# Altium schematic sheet stm32_schematic.SchDoc
size A3; SheetNumber: 1; SheetTotal: 1
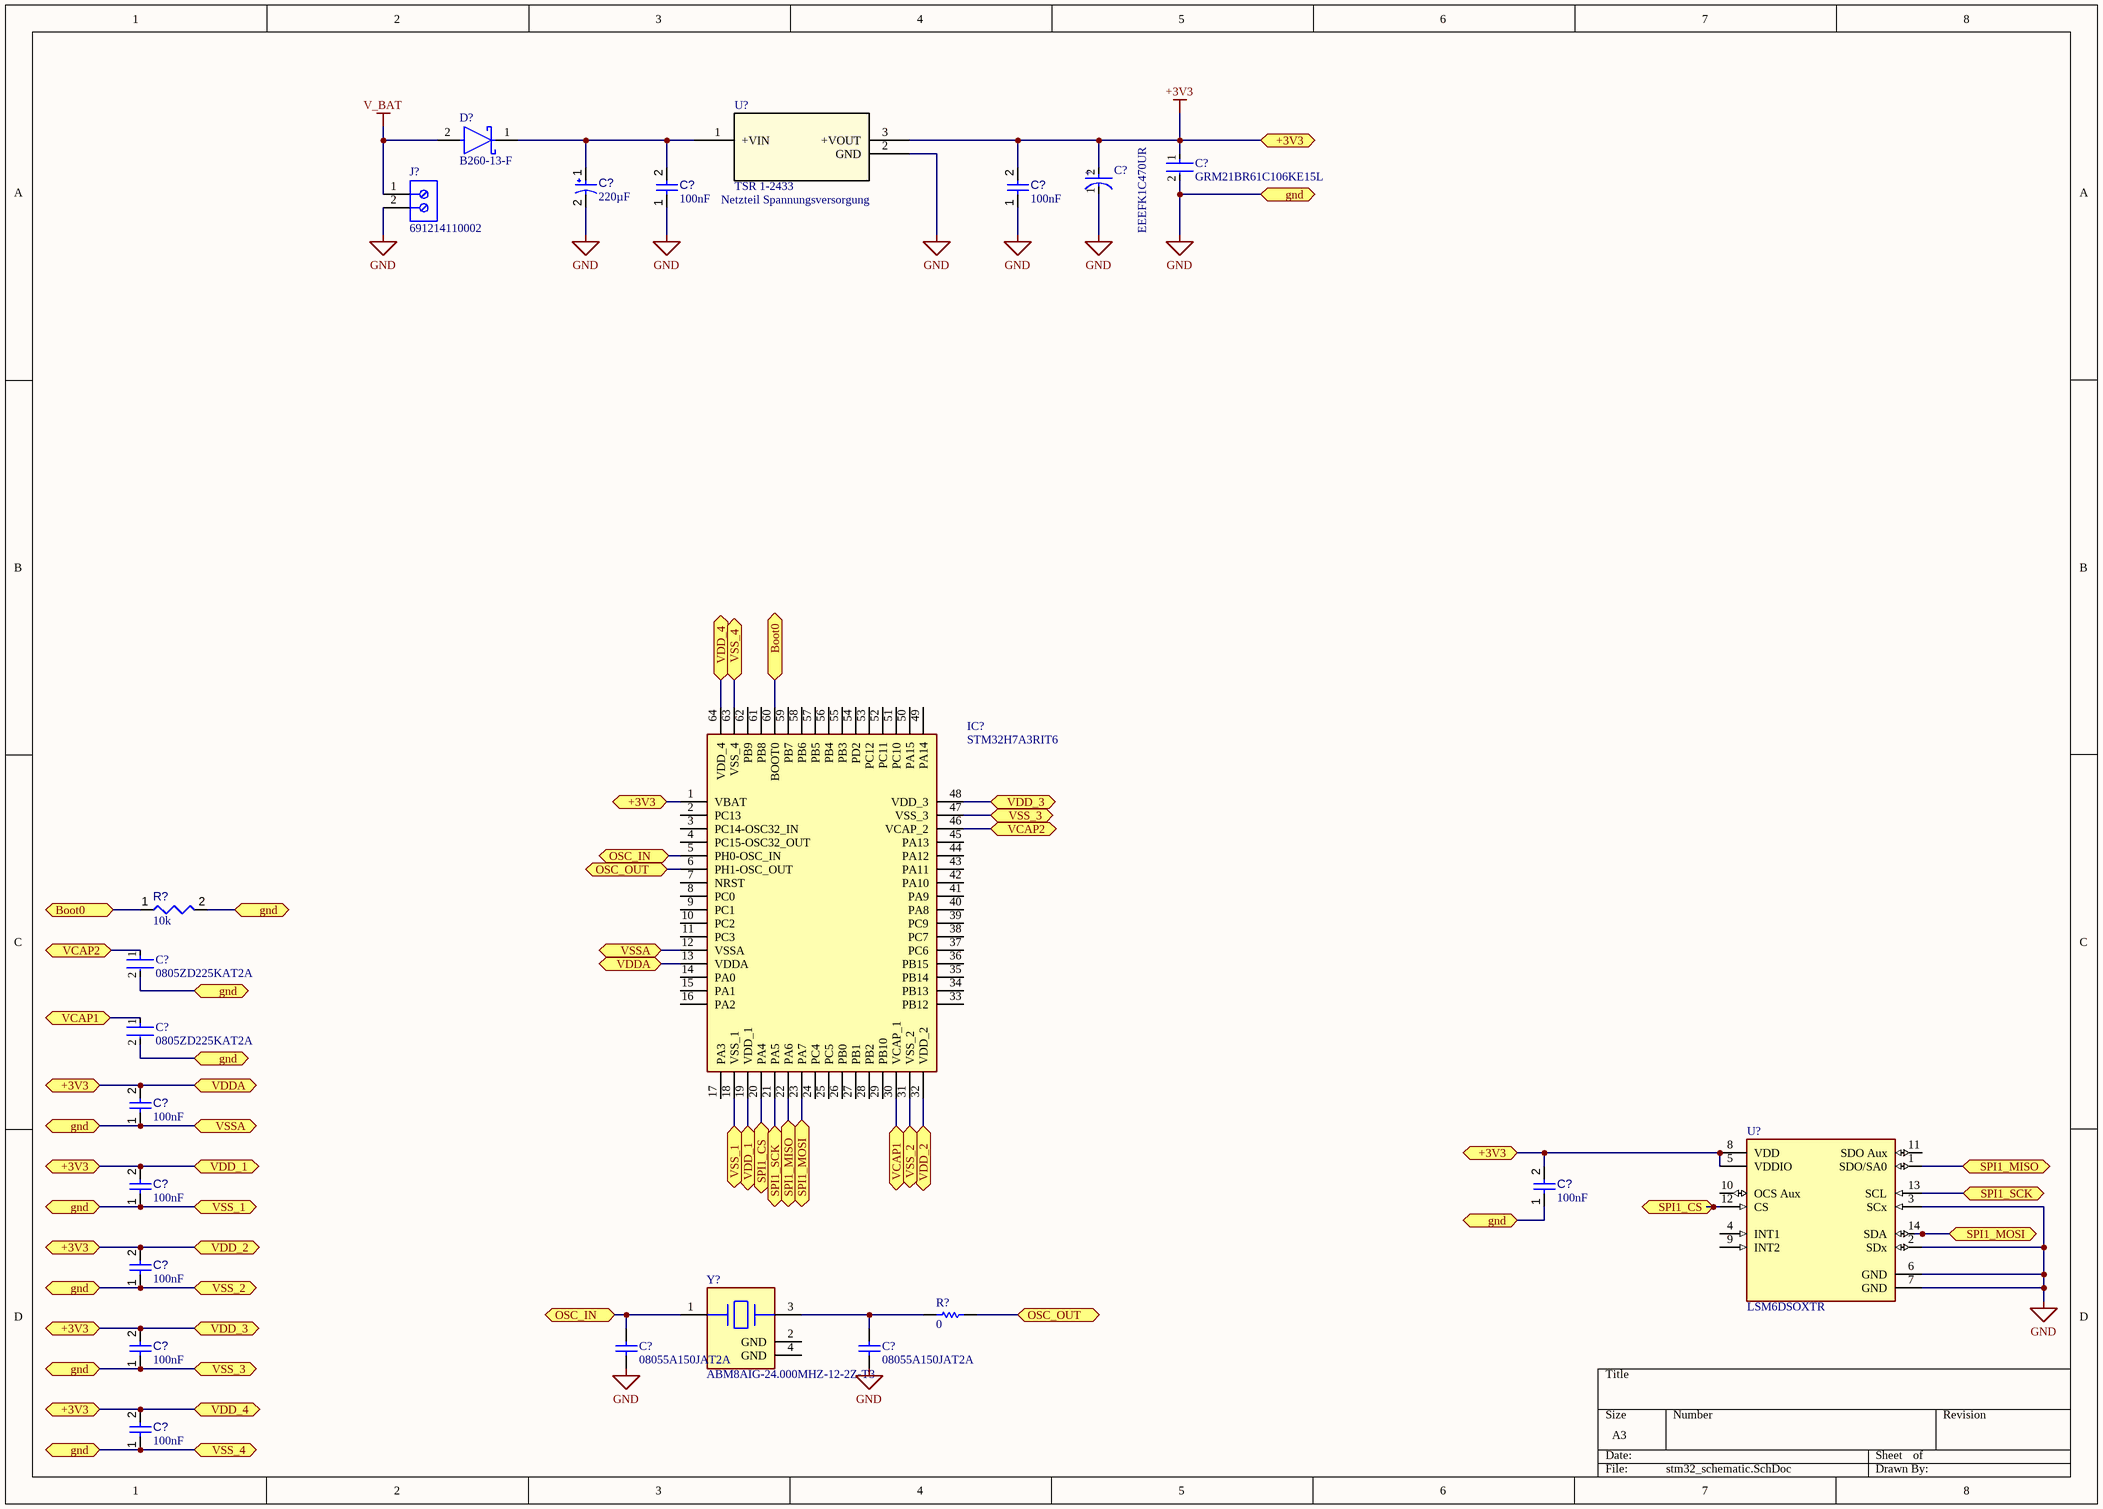
[diagram p0: stm32_schematic.SchDoc]

## Parts
(Parts that share a designator on the sheet are numbered #1, #2 ... from top to bottom, then left to right.)
C?#1  GRM21BR61C106KE15L  [FP-GRM21B-0_1-IPC_C]
C?#2  value 220µF  [CAPPR65-500-1250X1000X1350]  (hidden comment: ECA-1HM221)
C?#3  EEEFK1C470UR  [FP-FKC-MFG]
C?#4  value 100nF  [CAPC2013X95X50LL10T25]  (hidden comment: Capacitor 100 nF +/-10% 50 V 0805)
C?#5  value 100nF  [CAPC2013X95X50LL10T25]  (hidden comment: Capacitor 100 nF +/-10% 50 V 0805)
C?#6  0805ZD225KAT2A  [FP-0805-L_2_01_0_2-W_1_25-IPC_B]
C?#7  0805ZD225KAT2A  [FP-0805-L_2_01_0_2-W_1_25-IPC_B]
C?#8  value 100nF  [CAPC2013X95X50LL10T25]  (hidden comment: Capacitor 100 nF +/-10% 50 V 0805)
C?#9  value 100nF  [CAPC2013X95X50LL10T25]  (hidden comment: Capacitor 100 nF +/-10% 50 V 0805)
C?#10  value 100nF  [CAPC2013X95X50LL10T25]  (hidden comment: Capacitor 100 nF +/-10% 50 V 0805)
C?#11  value 100nF  [CAPC2013X95X50LL10T25]  (hidden comment: Capacitor 100 nF +/-10% 50 V 0805)
C?#12  08055A150JAT2A  [CAPC2013X140X50LL20T25]
C?#13  08055A150JAT2A  [CAPC2013X140X50LL20T25]
C?#14  value 100nF  [CAPC2013X95X50LL10T25]  (hidden comment: Capacitor 100 nF +/-10% 50 V 0805)
C?#15  value 100nF  [CAPC2013X95X50LL10T25]  (hidden comment: Capacitor 100 nF +/-10% 50 V 0805)
D?  B260-13-F  [FP-SMB-MFG]
IC?  STM32H7A3RIT6  [QFP50P1200X1200X160-64N]
J?  691214110002  [691214110002]
R?#1  value 10k  [RESC2013X50X35ML15T15]  (hidden comment: Resistor 10k +/-1% 0805 125 mW)
R?#2  value 0  [RESC2013X60X35ML10T20]  (hidden comment: Resistor 0R +/- 5% 0805 125 mW)
U?#1  TSR 1-2433  [TSR1-SINGLE_TRP]
U?#2  LSM6DSOXTR  [FP-LGA-14L-DM00249496-MFG]
Y?  ABM8AIG-24.000MHZ-12-2Z-T3  [FP-ABM8AIG-MFG]

## Ports
+3V3 (bidir, see stm32_schematic[1C], stm32_schematic[1D], stm32_schematic[3C], stm32_schematic[5A]), +3V3 (bidir, see stm32_schematic[1C], stm32_schematic[1D], stm32_schematic[3C], stm32_schematic[5A], stm32_schematic[6D]), +3V3 (bidir, see stm32_schematic[1C], stm32_schematic[1D], stm32_schematic[3C], stm32_schematic[6D]), +3V3 (bidir, see stm32_schematic[1C], stm32_schematic[1D], stm32_schematic[5A], stm32_schematic[6D]), +3V3 (bidir, see stm32_schematic[1D], stm32_schematic[3C], stm32_schematic[5A], stm32_schematic[6D]), Boot0 (bidir, see stm32_schematic[1C]), Boot0 (bidir, see stm32_schematic[3B]), gnd (bidir, see stm32_schematic[1C], stm32_schematic[1D], stm32_schematic[5A]), gnd (bidir, see stm32_schematic[1C], stm32_schematic[1D], stm32_schematic[5A], stm32_schematic[6D]), gnd (bidir, see stm32_schematic[1C], stm32_schematic[1D], stm32_schematic[6D]), OSC_IN (bidir, see stm32_schematic[3C]), OSC_IN (bidir, see stm32_schematic[3D]), OSC_OUT (bidir, see stm32_schematic[3C]), OSC_OUT (bidir, see stm32_schematic[4D]), SPI1_CS (bidir, see stm32_schematic[3D]), SPI1_CS (bidir, see stm32_schematic[7D]), SPI1_MISO (bidir, see stm32_schematic[3D]), SPI1_MISO (bidir, see stm32_schematic[8D]), SPI1_MOSI (bidir, see stm32_schematic[4D]), SPI1_MOSI (bidir, see stm32_schematic[8D]), SPI1_SCK (bidir, see stm32_schematic[3D]), SPI1_SCK (bidir, see stm32_schematic[8D]), VCAP1 (bidir, see stm32_schematic[1C]), VCAP1 (bidir, see stm32_schematic[4D]), VCAP2 (bidir, see stm32_schematic[1C]), VCAP2 (bidir, see stm32_schematic[4C]), VDD_1 (bidir, see stm32_schematic[1D]), VDD_1 (bidir, see stm32_schematic[3D]), VDD_2 (bidir, see stm32_schematic[1D]), VDD_2 (bidir, see stm32_schematic[4D]), VDD_3 (bidir, see stm32_schematic[1D]), VDD_3 (bidir, see stm32_schematic[4C]), VDD_4 (bidir, see stm32_schematic[1D]), VDD_4 (bidir, see stm32_schematic[3B]), VDDA (bidir, see stm32_schematic[1C]), VDDA (bidir, see stm32_schematic[3C]), VSS_1 (bidir, see stm32_schematic[1D]), VSS_1 (bidir, see stm32_schematic[3D]), VSS_2 (bidir, see stm32_schematic[1D]), VSS_2 (bidir, see stm32_schematic[4D]), VSS_3 (bidir, see stm32_schematic[1D]), VSS_3 (bidir, see stm32_schematic[4C]), VSS_4 (bidir, see stm32_schematic[1D]), VSS_4 (bidir, see stm32_schematic[3B]), VSSA (bidir, see stm32_schematic[1C]), VSSA (bidir, see stm32_schematic[3C])

## Nets
+3V3: C?#1.1 C?#3.2(A) C?#5.2 C?#8.2 C?#9.2 C?#10.2 C?#11.2 C?#14.2 C?#15.2 IC?.1(VBAT) IC?.13(VDDA) IC?.19(VDD_1) IC?.32(VDD_2) IC?.48(VDD_3) IC?.64(VDD_4) U?#1.3(+VOUT) U?#2.5(VDDIO) U?#2.8(VDD) ; port VDDA, port +3V3, port VDD_1, port VDD_2, port VDD_3, port VDD_4
GND: C?#1.2 C?#2.2 C?#3.1(C) C?#4.1 C?#5.1 C?#6.2 C?#7.2 C?#8.1 C?#9.1 C?#10.1 C?#11.1 C?#12.1 C?#13.1 C?#14.1 C?#15.1 IC?.12(VSSA) IC?.18(VSS_1) IC?.31(VSS_2) IC?.47(VSS_3) IC?.63(VSS_4) J?.2 R?#1.2 U?#1.2(GND) U?#2.2(SDx) U?#2.3(SCx) U?#2.6(GND) U?#2.7(GND) ; port VSSA, port gnd, port VSS_1, port VSS_2, port VSS_3, port VSS_4
V_BAT: D?.2(A) J?.1
Boot0: IC?.60(BOOT0) R?#1.1 ; port Boot0
OSC_IN: C?#12.2 IC?.5(PH0-OSC_IN) Y?.1 ; port OSC_IN
OSC_OUT: IC?.6(PH1-OSC_OUT) R?#2.2 ; port OSC_OUT
SPI1_CS: IC?.20(PA4) U?#2.12(CS) ; port SPI1_CS
SPI1_MISO: IC?.22(PA6) U?#2.1(SDO/SA0) ; port SPI1_MISO
SPI1_MOSI: IC?.23(PA7) U?#2.14(SDA) ; port SPI1_MOSI
SPI1_SCK: IC?.21(PA5) U?#2.13(SCL) ; port SPI1_SCK
VCAP1: C?#7.1 IC?.30(VCAP_1) ; port VCAP1
VCAP2: C?#6.1 IC?.46(VCAP_2) ; port VCAP2
NetC?#2_1: C?#2.1 C?#4.2 D?.1(C) U?#1.1(+VIN)
NetC?#13_2: C?#13.2 R?#2.1 Y?.3

Not connected (* = marked no-connect by the designer): IC? 2(PC13) 3(PC14-OSC32_IN) 4(PC15-OSC32_OUT) 7(NRST) 8(PC0) 9(PC1) 10(PC2) 11(PC3) 14(PA0) 15(PA1) 16(PA2) 17(PA3) 24(PC4) 25(PC5) 26(PB0) 27(PB1) 28(PB2) 29(PB10) 33(PB12) 34(PB13) 35(PB14) 36(PB15) 37(PC6) 38(PC7) 39(PC9) 40(PA8) 41(PA9) 42(PA10) 43(PA11) 44(PA12) 45(PA13) 49(PA14) 50(PA15) 51(PC10) 52(PC11) 53(PC12) 54(PD2) 55(PB3) 56(PB4) 57(PB5) 58(PB6) 59(PB7) 61(PB8) 62(PB9); U?#2 4(INT1) 9(INT2) 10(OCS_Aux) 11(SDO_Aux); Y? 2(GND) 4(GND)

## Notes on the sheet
- Netzteil Spannungsversorgung
- (in symbol CMP-05427-002132-1) +

## Library data of the parts
C?#1 = CMP-2007-03453-2: Chip Multilayer Ceramic Capacitors for General Purpose, 0805, 10uF, X5R, 15%, 10%, 16V; Radiation Hardening: No; Thickness: 0.053inch; Voltage Rating (DC): 16V; Lead Free: Lead Free; Package Quantity: 1; Width: 1.25mm; Case Code (Imperial): 0805; Depth: 1.25mm; Packaging: Tape and Reel; Dielectric: X5R; Max Operating Temperature: 85°C; Tolerance: 10%; Voltage Rating: 16V; Voltage: 16V; Capacitance: 10uF; Height: 1.25mm; Case Code (Metric): 2012; Material: Ceramic; Mount: Surface Mount; Case/Package: 0805; REACH SVHC: No SVHC; Length: 2mm; Min Operating Temperature: -55°C; Termination: SMD/SMT
C?#2 = CMP-001-00028-7: Aluminum Electrolytic Capacitor, 220 uF, +/- 20%, 50 V, -40 to 85 degC, 2-Pin THD, RoHS, Bulk; Manufacturer: Panasonic; Ripple Current (AC): 400mA; Voltage Rating: 50V; Case/Package: Radial; Packaging: Bulk; Package Quantity: 200; Min Operating Temperature: -40°C; Datasheet Version: Mar-16; Package Reference: CAPPR65-500-1250X1000X1350; Mounting Technology: TH; Ripple Current: 400mA; Pins: 2; Package Description: 2-Pin Radial Lead, Dia 10 mm, Body Length 12.5 mm; RoHS Compliant: True; Max Operating Temperature: 85°C; Lead Pitch: 5mm; Tolerance: 20%; Manufacturer URL: http://www.panasonic.com/; Diameter: 10mm; Capacitor Type: Electrolytic; Datasheet URL: http://industrial.panasonic.com/cdbs/www-data/pdf/RDF0000/DMF0000COL68.pdf
C?#3 = CMP-05427-002132-1: CAP ALUM 47UF 20% 16V SMD; Dielectric Material: Aluminium; ESR (Equivalent Series Resistance): 700mR; Ripple Current: 160mA; Life (Hours): 2000Hour; Leakage Current: 3uA; Voltage: 10V; Length: 5.8mm; Voltage Rating: 16V; Ratings: AEC-Q200; Package Quantity: 1000; Min Operating Temperature: -55°C; Mount: Surface Mount; Width: 6.5mm; Voltage Rating (DC): 16V; Radiation Hardening: No; Diameter: 5mm; RoHS Compliant: Yes; Reach SVHC Compliant: Yes; Termination: SMD/SMT; Material: Aluminium; Ripple Current (AC): 160mA; Impedance: 700mR; Series: FK; Height - Seated (Max): 0.228inch; Packaging: Tape and Reel; Height: 5.8mm; Capacitance: 47uF; Contact Plating: Tin; Construction: Cylindrical; Number of Pins: 2; Lead Free: Lead Free; Tolerance: 20%; Max Operating Temperature: 105°C; Case/Package: Radial
C?#4 C?#5 C?#8-C?#11 C?#14 C?#15 = CMP-001-00018-6: Chip Capacitor, 100 nF, +/- 10%, 50 V, 0805 (2012 Metric); Capacitor Type: Ceramic; Voltage Rating: 50V; Pins: 2; Max Operating Temperature: 125°C; Min Operating Temperature: -55°C; Mounting Technology: SM; Case/Package: 0805; RoHS Compliant: True; Tolerance: 10%
C?#6 C?#7 = CMP-2000-05810-2: General Purpose Ceramic Capacitor, 0805, 2.2uF, 10%, X5R, 15%, 10V; Insulation Resistance: 500MR; Dissipation Factor: 5%; Termination: SMD/SMT; Length: 2.01mm; Lead Free: Lead Free; Voltage: 10V; Height: 1.4mm; Contact Plating: Tin; Dielectric: X5R; Voltage Rating (DC): 10V; REACH SVHC: No SVHC; Voltage Rating: 10V; Depth: 1.25mm; Min Operating Temperature: -55°C; Tolerance: 10%; Case Code (Metric): 2012; Max Operating Temperature: 85°C; Radiation Hardening: No; Dielectric Material: Ceramic; Packaging: Tape and Reel; Construction: Flat; Case Code (Imperial): 0805; RoHS Compliant: Yes; Package Quantity: 1; Capacitance: 2.2uF; Series: -; Size: 1.4mm; Number of Pins: 2; Width: 0.049inch; Mount: Surface Mount; Thickness: 0.055inch; Case/Package: 0805
C?#12 C?#13 = CMP-2007-04621-1: Manufacturer: AVX Interconnect / Elco; Part Number: 08055A150JAT2A
D? = CMP-12790-000014-1: DIODE SCHOTTKY 60V 2A SMB; Manufacturer: Diodes Inc.; Max Surge Forward Current: 50A; Value: 200pF; Max Junction Temp: +150°C; Standoff Height: 0.05mm; Peak Reverse Current: 0.5mA; Device Class L1: Discrete Semiconductors; Temperature Range High: +150°C; Device Class L3: Schottky Diodes; ComponentLink2Description: Datasheet; Height: 2.5mm; Automotive: No; ComponentLink2URL: https://www.diodes.com/assets/Datasheets/ds13004.pdf; Temperature: -65°C to +150°C; Mouser Description: Schottky Diodes & Rectifiers 60V 2A; Temperature Range Low: -65°C; Capacitance: 200pF; Device Class L2: Diodes; Forward Current: 2A; Lead Free: Yes; Manufacturer Part Number: B260-13-F; Octopart: https://octopart.com/b260-13-f-diodes+inc.-325789; Max Repetitive Reverse Voltage: 60V; Reverse Voltage: 60V; Package: SMB; Footprint Url: https://www.diodes.com/assets/Package-Files/SMB.pdf; Digikey Description: DIODE SCHOTTKY 60V 2A SMB; Category: Diode; RoHS: TRUE
IC? = STM32H7A3RIT6: Integrated Circuit; Manufacturer_Name: STMicroelectronics; Datasheet Link: https://www.st.com/resource/en/datasheet/stm32h7a3ai.pdf; Height: 1.6mm; Manufacturer_Part_Number: STM32H7A3RIT6; Mouser Part Number: 511-STM32H7A3RIT6; Mouser Price/Stock: https://www.mouser.co.uk/ProductDetail/STMicroelectronics/STM32H7A3RIT6?qs=xZ%2FP%252Ba9zWqZAEQXxnLVEdg%3D%3D; Arrow Part Number: STM32H7A3RIT6; Arrow Price/Stock: https://www.arrow.com/en/products/stm32h7a3rit6/stmicroelectronics
J? = CMP-1502-02464-2: NexarPartId: 18818288; Plating: Brass, Steel; Current: 10A; Pitch: 3.5052mm; Number of Levels: 1; Number of Contacts: 2; Wire Gauge (Min): 16AWG; Voltage: 300V; Wire Gauge (Max): 24AWG; Stripping Length: -6mm; Number of Pins: 2; Number of Rows: 1; REACH SVHC: Unknown; RoHS: Compliant; Housing Material: Nylon; Termination: Screw; Mount: Through Hole; Contact Plating: Brass, Tin; Number of Positions Per Level: 2; Color: Blue, Green; Width: 7.9mm; Voltage Rating: 300V; Length: 7.4mm; Current Rating: 10A; Wire/Cable Gauge: 24AWG; Packaging: Box; Max Operating Temperature: 105°C; Lead Pitch: 3.5mm; Height: 8.7mm; Contact Material: Brass; Min Operating Temperature: -40°C
R?#1 = CMP-009-00018-5: Chip Resistor, 10 KOhm, +/- 1%, 125 mW, -55 to 155 degC, 0805 (2012 Metric); Power: 125mW; Voltage Rating: 150V; Tolerance: 1%; Pins: 2; Min Operating Temperature: -55°C; Case/Package: 0805; Max Operating Temperature: 155°C; RoHS Compliant: True; Mounting Technology: SM
R?#2 = CMP-009-00007-5: Chip Resistor, 0 Ohm, 0.125 W, -55 to 155 degC, 0805 (2012 Metric); Power: 125mW; Voltage Rating: 50V; RoHS Compliant: True; Max Operating Temperature: 155°C; Case/Package: 0805; Mounting Technology: SM; Min Operating Temperature: -55°C; Tolerance: 5%; Pins: 2
U?#1 = CMP-2000-05426-2: NexarPartId: 9539342; Nominal Output Voltage: 3.3V; Max Input Voltage: 36V; Max Output Power: 3.3W; Min Input Voltage: 4.75V; Nominal Supply Current: 1mA; Output Type: Fixed; Max Output Current: 1A; Min Input Voltage (DC): 5.5V; Efficiency: 79%; Number of Outputs: 1; Isolation: Isolated; Max Input Voltage (DC): 32V; Switching Frequency: 500kHz; Radiation Hardening: No; REACH SVHC: No SVHC; Mount: Through Hole; Height: 10.2mm; Max Operating Temperature: 85°C; RoHS: Compliant; Output Power: 3.3W; Min Supply Voltage: 4.75V; Weight: 1.9g; Power Rating: 3.3W; Number of Pins: 3; Output Current: 1A; Min Operating Temperature: -40°C; Length: 11.7mm; Case/Package: SIP; Output Voltage: 3.3V; Max Supply Voltage: 36V; Depth: 7.6mm; Width: 7.6mm
U?#2 = CMP-12177-000010-1: INEMO INERTIAL MODULE: 3D ACCELE; Manufacturer: STMicroelectronics; Sensor Type: Temperature,Accelerometer,Gyroscope; Accel Range: 2/4/8/16g; Accel Sensitivity: 0.061/0.122/0.244/0.488mV/g; Operating Supply Current: 0.55mA; Gyro Range: 125/250/500/1000/2000°/s; Gyro Sensitivity: 4.375/8.75/17.5/35/70LSB/°/s; Sensor Output: I2C,SPI,Other; Min Supply Voltage: 1.62V; Max Supply Voltage: 3.6V; Octopart: https://octopart.com/lsm6dsoxtr-stmicroelectronics-98102600; Package: LGA-14L-DM00249496; Footprint Url: https://www.st.com/content/ccc/resource/technical/document/technical_note/73/17/9c/16/dd/96/4a/01/CD00134799.pdf/files/CD00134799.pdf/jcr:content/translations/en.CD00134799.pdf; ComponentLink2Description: Datasheet; Mouser Description: LSM6DSOX: 3.6 V 3 Axis Accelerometer Gyroscope iNEMO Inertial Module - LGA-14L; ComponentLink2URL: https://www.st.com/resource/en/datasheet/lsm6dsox.pdf; Temperature Range Low: -40°C; Digikey Description: INEMO INERTIAL MODULE: 3D ACCELE; Lead Free: Yes; Device Class L3: Inertial Measurement Units (IMUs); Category: IC; Device Class L2: Motion Sensors; RoHS: TRUE; Temperature: -40°C to +85°C; Height: 0.86mm; Device Class L1: Sensors; Temperature Range High: +85°C; Manufacturer Part Number: LSM6DSOXTR; Automotive: No
Y? = CMP-27762-015716-1: Crystal 24MHz ±20ppm (Tol) ±50ppm (Stability) 12pF FUND 50Ω Automotive 4-Pin Ultra Mini-CSMD T/R; ESR (Equivalent Series Resistance): 50R; Series: ABM8AIG; RoHS Compliant: Yes; Load Capacitance: 12pF; Height: 0.031inch; Min Operating Temperature: -40°C; Mount: Surface Mount; Packaging: Cut Tape; Ratings: AEC-Q200; Case/Package: SMD/SMT; Frequency Stability: 50ppm; Max Operating Temperature: 125°C; Length: 0.126inch; Frequency: 24MHz; Frequency Tolerance: 20ppm; Width: 0.098inch